# Altium schematic sheet power_REG104GA_1V8.SchDoc
size A4
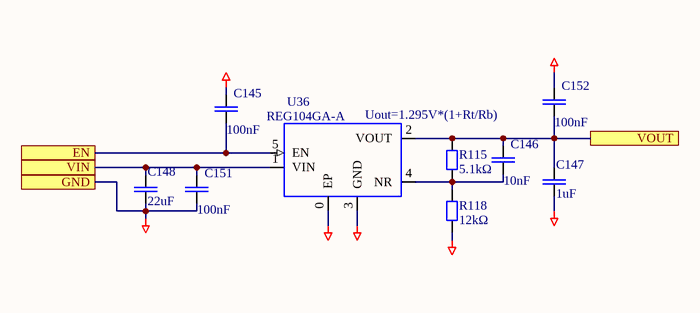
[diagram p0: power_REG104GA_1V8.SchDoc]

## Parts
C145  100nF  [CAPC1608N]
C146  10nF  [CAPC1608N]
C147  1uF  [CAPC2012N]
C148  22uF  [CAPC2012N]
C151  100nF  [CAPC1608N]
C152  100nF  [CAPC1608N]
R115  5.1kΩ  [RESC2012N]
R118  12kΩ  [RESC2012N]
U36  REG104GA-A  [SOT223]

## Ports
EN, GND, VIN, VOUT

## Nets
GND: C145.2 C147.1 C148.1 C151.1 C152.2 R118.1 U36.0(EP) U36.3(GND) ; port GND
EN: C145.1 U36.5(EN) ; port EN
VIN: C148.2 C151.2 U36.1(VIN) ; port VIN
VOUT: C146.2 C147.2 C152.1 R115.2 U36.2(VOUT) ; port VOUT
NetC146_1: C146.1 R115.1 R118.2 U36.4(NR)

## Notes on the sheet
- (near U36) Uout=1.295V*(1+Rt/Rb)

## Library data of the parts
C145 C146 C151 C152 = CAPC: Generic ceramic SMD capacitor; Pkg: 0603; Maintainer: Evgeniy Kotov; SMD Solders: 2; THD Solders: 0; Last Change Data: 06.03.2017; Release Date: 06.03.2017
  C145 C151 C152: PartField: 100nF; Value: 100nF
  C146: PartField: 10nF; Value: 10nF
C147 C148 = CAPC: Generic ceramic SMD capacitor; Pkg: 0805; Maintainer: Evgeniy Kotov; SMD Solders: 2; THD Solders: 0; Voltage Rating: 10V; Last Change Data: 06.03.2017; Release Date: 06.03.2017
  C147: PartField: 1uF; Value: 1uF
  C148: PartField: 22uF; Value: 22uF
R115 R118 = RESC: Resistor, Generic, SMD; Pkg: 0805; Maintainer: Evgeniy Kotov; SMD Solders: 2; THD Solders: 0; Release Date: 06.03.2017; Last Change Data: 09.03.2017
  R115: PartField: 5.1kΩ; Value: 5.1kΩ
  R118: PartField: 12kΩ; Value: 12kΩ
U36 = REG104GA-A: Single Output LDO, 1.0A, Adj.(1.295 to 5.5V), Low Noise, Fast Transient Response; Manufacturer: Texas Instruments; Manufacturer_Part_Number: reg104-a_dcq_6; INDUSTRY_STD_PKG_TYPE: SOT-223; FAMILY_NAME: SINGLE CHANNEL LDO; PIN_COUNT: 6; PACKAGE_DESIGNATOR: DCQ; Pkg: SOT-5EP; THD Solders: 0; Value: REG104GA-A; Datasheet URL: http://www.ti.com/lit/gpn/REG104-A; GENERIC_PART_NUMBER: REG104GA-A; Vendor: Texas Instruments; SMD Solders: 6; PartField: REG104GA-A